# Altium schematic sheet UniConnector.SchDoc
size A; SheetNumber: 5; SheetTotal: 5
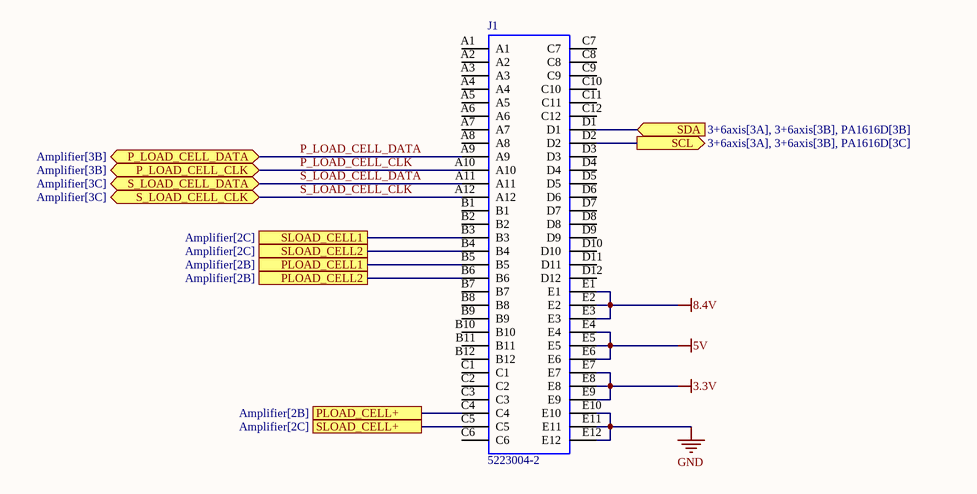
[diagram p0: UniConnector.SchDoc]

## Parts
J1  5223004-2  [52230042]

## Ports
P_LOAD_CELL_CLK (bidir, see Amplifier[3B]), P_LOAD_CELL_DATA (bidir, see Amplifier[3B]), PLOAD_CELL1 (see Amplifier[2B]), PLOAD_CELL2 (see Amplifier[2B]), PLOAD_CELL+ (see Amplifier[2B]), S_LOAD_CELL_CLK (bidir, see Amplifier[3C]), S_LOAD_CELL_DATA (bidir, see Amplifier[3C]), SCL (out, see 3+6axis[3A], 3+6axis[3B], PA1616D[3C]), SDA (in, see 3+6axis[3A], 3+6axis[3B], PA1616D[3B]), SLOAD_CELL1 (see Amplifier[2C]), SLOAD_CELL2 (see Amplifier[2C]), SLOAD_CELL+ (see Amplifier[2C])

## Nets
3.3V: J1.E7 J1.E8 J1.E9
5V: J1.E4 J1.E5 J1.E6
8.4V: J1.E1 J1.E2 J1.E3
GND: J1.E10 J1.E11 J1.E12
P_LOAD_CELL_CLK: J1.A10 ; port P_LOAD_CELL_CLK
P_LOAD_CELL_DATA: J1.A9 ; port P_LOAD_CELL_DATA
PLOAD_CELL1: J1.B5 ; port PLOAD_CELL1
PLOAD_CELL2: J1.B6 ; port PLOAD_CELL2
PLOAD_CELL+: J1.C4 ; port PLOAD_CELL+
S_LOAD_CELL_CLK: J1.A12 ; port S_LOAD_CELL_CLK
S_LOAD_CELL_DATA: J1.A11 ; port S_LOAD_CELL_DATA
SCL: J1.D2 ; port SCL
SDA: J1.D1 ; port SDA
SLOAD_CELL1: J1.B3 ; port SLOAD_CELL1
SLOAD_CELL2: J1.B4 ; port SLOAD_CELL2
SLOAD_CELL+: J1.C5 ; port SLOAD_CELL+

Not connected (* = marked no-connect by the designer): J1 A1 A2 A3 A4 A5 A6 A7 A8 B1 B2 B7 B8 B9 B10 B11 B12 C1 C2 C3 C6 C7 C8 C9 C10 C11 C12 D3 D4 D5 D6 D7 D8 D9 D10 D11 D12

## Library data of the parts
J1 = 5223004-2: Conn Backplane RCP 60 POS 2mm Solder RA Thru-Hole Tube; Manufacturer_Name: TE Connectivity; Geometry.Height: 14mm; Mouser Part Number: 571-5223004-2; Mouser Price/Stock: https://www.mouser.co.uk/ProductDetail/TE-Connectivity/5223004-2?qs=oNRo%252BTjlpTO6tP0xSX%252BI3w%3D%3D; Manufacturer_Part_Number: 5223004-2; Datasheet Link: https://www.te.com/commerce/DocumentDelivery/DDEController?Action=srchrtrv&DocNm=5223004&DocType=Customer+Drawing&DocLang=English